# Altium schematic sheet BOOST CNTRL CARD.SchDoc
size A3; SheetNumber: 1; SheetTotal: 2; SPICEModelCacheXBHTOMAF: <root> / <DocumentId>XBHTOMAF</DocumentId> / <CacheFrame Number="0"> / <Model Name="0805_885012207098_100nf" Kind="CKT"> / <Text>******* / .subckt 0805_885012207098_100nF 1 2 / Rser 1 3 0.0175748078756 / Lser 2 4 0.0000000004 / C1 3 4 0.0000001 / Rpar 3 4 5000000000 / .ends 0805_885012207098_100nF</Text> / </Model> / <Model Name="865080753013_47uf" Kind="CKT"> / <Text>******* / .subckt 865080753013_47uF 1 2 / Rser 1 3 0.566 / Lser 2 4 3.250953097E-09 / C1 3 4 0.000047 / Rpar 3 4 2127659.57446809 / .ends 865080753013_47uF</Text> / </Model> / <Model Name="0402_885012205042_470pf" Kind="CKT"> / <Text>******* / .subckt 0402_885012205042_470pF 1 2 / Rser 1 3 0.34662 / Lser 2 4 0.00000000017045 / C1 3 4 0.00000000047 / Rpar 3 4 10000000000 / .ends 0402_885012205042_470pF</Text> / </Model> / <Model Name="0402_885012205085r_100nf" Kind="CKT"> / <Text>******* / .subckt 0402_885012205085R_100nF 1 2 / Rser 1 3 0.035 / Lser 2 4 7.65573672E-10 / C1 3 4 0.0000001 / Rpar 3 4 5000000000 / .ends 0402_885012205085R_100nF</Text> / </Model> / <Model Name="0201_885012204006_1nf" Kind="CKT"> / <Text>******* / .subckt 0201_885012204006_1nF 1 2 / Rser 1 3 0.2367 / Lser 2 4 0.000000000173 / C1 3 4 0.000000001 / Rpar 3 4 10000000000 / .ends 0201_885012204006_1nF</Text> / </Model> / <Model Name="0201_885012204004_10nf" Kind="CKT"> / <Text>******* / .subckt 0201_885012204004_10nF 1 2 / Rser 1 3 0.0709 / Lser 2 4 0.00000000018 / C1 3 4 0.00000001 / Rpar 3 4 10000000000 / .ends 0201_885012204004_10nF</Text> / </Model> / <Model Name="0402_885012005067_1nf" Kind="CKT"> / <Text>******* / .subckt 0402_885012005067_1nF 1 2 / Rser 1 3 0.065 / Lser 2 4 0.000000001 / C1 3 4 0.000000001 / Rpar 3 4 10000000000 / .ends 0402_885012005067_1nF</Text> / </Model> / <Model Name="865230440002_10uf" Kind="CKT"> / <Text>******* / .subckt 865230440002_10uF 1 2 / Rser 1 3 1.95 / Lser 2 4 0.00000000000007 / C1 3 4 0.000022 / Rpar 3 4 8333333.33333333 / .ends 865230440002_10uF</Text> / </Model> / </CacheFrame> / </root>
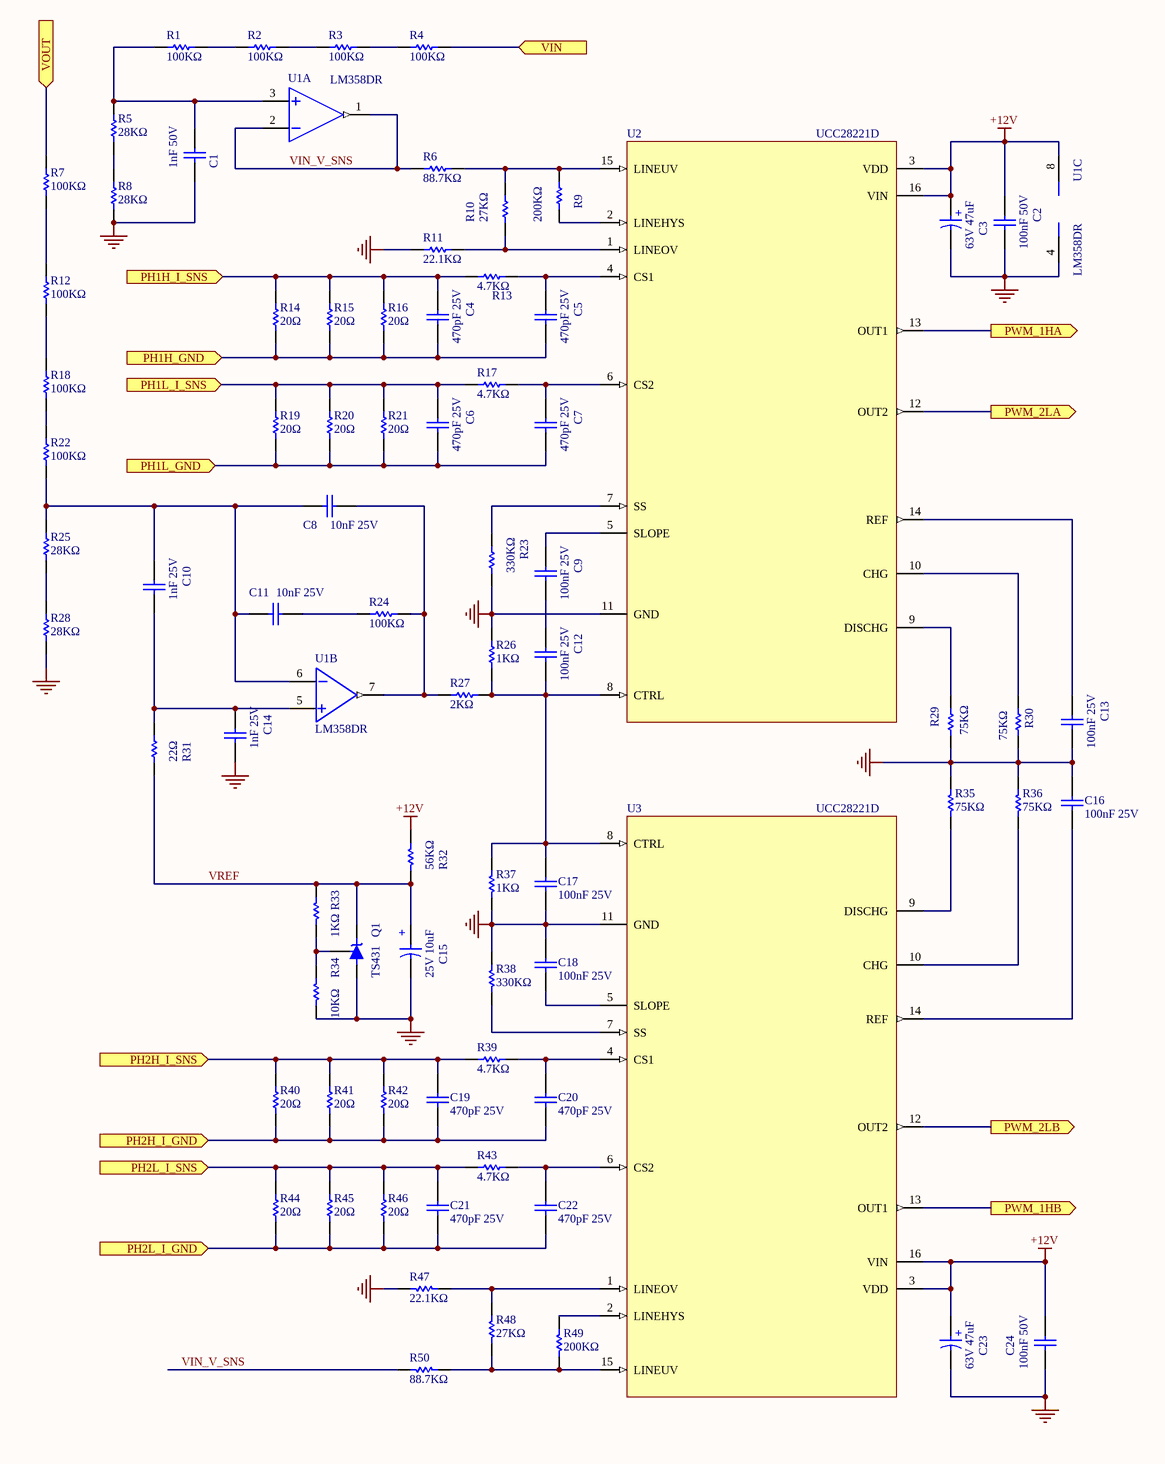
[diagram p0: BOOST CNTRL CARD.SchDoc]

## Parts
C1  1nF 50V  [WCAP-CSGP_0402_L1W0.5H0.5]
C2  100nF 50V  [WCAP-CSGP_0805_L2W1.25H0.8_Reflow]
C3  63V 47uF  [WCAP-ASLI_D8H10.5]
C4  470pF 25V  [WCAP-CSGP_0402_L1W0.5H0.5]
C5  470pF 25V  [WCAP-CSGP_0402_L1W0.5H0.5]
C6  470pF 25V  [WCAP-CSGP_0402_L1W0.5H0.5]
C7  470pF 25V  [WCAP-CSGP_0402_L1W0.5H0.5]
C8  10nF 25V  [WCAP-CSGP_0201_L0.6W0.3H0.3]
C9  100nF 25V  [WCAP-CSGP_0402_L1W0.5H0.5]
C10  1nF 25V  [WCAP-CSGP_0201_L0.6W0.3H0.3]
C11  10nF 25V  [WCAP-CSGP_0201_L0.6W0.3H0.3]
C12  100nF 25V  [WCAP-CSGP_0402_L1W0.5H0.5]
C13  100nF 25V  [WCAP-CSGP_0402_L1W0.5H0.5]
C14  1nF 25V  [WCAP-CSGP_0201_L0.6W0.3H0.3]
C15  25V 10uF  [WCAP-AS5H_D4H5.5]
C16  100nF 25V  [WCAP-CSGP_0402_L1W0.5H0.5]
C17  100nF 25V  [WCAP-CSGP_0402_L1W0.5H0.5]
C18  100nF 25V  [WCAP-CSGP_0402_L1W0.5H0.5]
C19  470pF 25V  [WCAP-CSGP_0402_L1W0.5H0.5]
C20  470pF 25V  [WCAP-CSGP_0402_L1W0.5H0.5]
C21  470pF 25V  [WCAP-CSGP_0402_L1W0.5H0.5]
C22  470pF 25V  [WCAP-CSGP_0402_L1W0.5H0.5]
C23  63V 47uF  [WCAP-ASLI_D8H10.5]
C24  100nF 50V  [WCAP-CSGP_0805_L2W1.25H0.8_Reflow]
Q1  TS431  [TO-92]
R1  100KΩ  [WRIS-RSKS_0402]
R2  100KΩ  [WRIS-RSKS_0402]
R3  100KΩ  [WRIS-RSKS_0402]
R4  100KΩ  [WRIS-RSKS_0402]
R5  28KΩ  [WRIS-RSKS_0402]
R6  88.7KΩ  [WRIS-RSKS_0402]
R7  100KΩ  [WRIS-RSKS_0402]
R8  28KΩ  [WRIS-RSKS_0402]
R9  200KΩ  [WRIS-RSKS_0402]
R10  27KΩ  [WRIS-RSKS_0402]
R11  22.1KΩ  [WRIS-RSKS_0402]
R12  100KΩ  [WRIS-RSKS_0402]
R13  4.7KΩ  [WRIS-RSKS_0402]
R14  20Ω  [WRIS-RSKS_0402]
R15  20Ω  [WRIS-RSKS_0402]
R16  20Ω  [WRIS-RSKS_0402]
R17  4.7KΩ  [WRIS-RSKS_0402]
R18  100KΩ  [WRIS-RSKS_0402]
R19  20Ω  [WRIS-RSKS_0402]
R20  20Ω  [WRIS-RSKS_0402]
R21  20Ω  [WRIS-RSKS_0402]
R22  100KΩ  [WRIS-RSKS_0402]
R23  330KΩ  [WRIS-RSKS_0402]
R24  100KΩ  [WRIS-RSKS_0402]
R25  28KΩ  [WRIS-RSKS_0402]
R26  1KΩ  [WRIS-RSKS_0402]
R27  2KΩ  [WRIS-RSKS_0402]
R28  28KΩ  [WRIS-RSKS_0402]
R29  75KΩ  [WRIS-RSKS_0603_Reflow]
R30  75KΩ  [WRIS-RSKS_0603_Reflow]
R31  22Ω  [WRIS-RSKS_0402]
R32  56KΩ  [WRIS-RSKS_0402]
R33  1KΩ  [WRIS-RSKS_0402]
R34  10KΩ  [WRIS-RSKS_0402]
R35  75KΩ  [WRIS-RSKS_0603_Reflow]
R36  75KΩ  [WRIS-RSKS_0603_Reflow]
R37  1KΩ  [WRIS-RSKS_0402]
R38  330KΩ  [WRIS-RSKS_0402]
R39  4.7KΩ  [WRIS-RSKS_0402]
R40  20Ω  [WRIS-RSKS_0402]
R41  20Ω  [WRIS-RSKS_0402]
R42  20Ω  [WRIS-RSKS_0402]
R43  4.7KΩ  [WRIS-RSKS_0402]
R44  20Ω  [WRIS-RSKS_0402]
R45  20Ω  [WRIS-RSKS_0402]
R46  20Ω  [WRIS-RSKS_0402]
R47  22.1KΩ  [WRIS-RSKS_0402]
R48  27KΩ  [WRIS-RSKS_0402]
R49  200KΩ  [WRIS-RSKS_0402]
R50  88.7KΩ  [WRIS-RSKS_0402]
U1  LM358DR  [SOIC-08-IPC_A]  (parts A,B,C of 3)
U2  UCC28221D  [D0016A_N]
U3  UCC28221D  [D0016A_N]

## Ports
PH1H_GND (in), PH1H_I_SNS (in), PH1L_GND (in), PH1L_I_SNS (in), PH2H_I_GND (in), PH2H_I_SNS (in), PH2L_I_GND (in), PH2L_I_SNS (in), PWM_1HA (out), PWM_1HB (out), PWM_2LA (out), PWM_2LB (out), VIN (in), VOUT (in)

## Nets
+12V: C2.2 C3.1(P) C23.1(P) C24.2 R32.2 U1.8(V+) U2.3(VDD) U2.16(VIN) U3.3(VDD) U3.16(VIN)
GND: C1.1 C2.1 C3.2(N) C13.1 C14.1 C15.2(N) C16.1 C17.2 C18.1 C23.2(N) C24.1 Q1.1(A) R8.1 R11.1 R23.1 R26.2 R28.1 R29.1 R30.1 R34.1 R35.1 R36.1 R37.2 R38.1 R47.1 U1.4(V-) U2.11(GND) U3.11(GND)
PH1H_GND: C4.1 C5.1 R14.1 R15.1 R16.1 ; port PH1H_GND
PH1H_I_SNS: C4.2 R13.1 R14.2 R15.2 R16.2 ; port PH1H_I_SNS
PH1L_GND: C6.1 C7.1 R19.1 R20.1 R21.1 ; port PH1L_GND
PH1L_I_SNS: C6.2 R17.1 R19.2 R20.2 R21.2 ; port PH1L_I_SNS
PH2H_I_GND: C19.1 C20.1 R40.1 R41.1 R42.1 ; port PH2H_I_GND
PH2H_I_SNS: C19.2 R39.1 R40.2 R41.2 R42.2 ; port PH2H_I_SNS
PH2L_I_GND: C21.1 C22.1 R44.1 R45.1 R46.1 ; port PH2L_I_GND
PH2L_I_SNS: C21.2 R43.1 R44.2 R45.2 R46.2 ; port PH2L_I_SNS
PWM_1HA: U2.13(OUT1) ; port PWM_1HA
PWM_1HB: U3.13(OUT1) ; port PWM_1HB
PWM_2LA: U2.12(OUT2) ; port PWM_2LA
PWM_2LB: U3.12(OUT2) ; port PWM_2LB
VIN: R4.2 ; port VIN
VIN_V_SNS: R6.2 R50.2 U1.1(1OUT) U1.2(IN1-)
VOUT: R7.2 ; port VOUT
VREF: C15.1(P) Q1.1(K) R31.1 R32.1 R33.2
NetC1_2: C1.2 R1.1 R5.2 U1.3(IN1+)
NetC5_2: C5.2 R13.2 U2.4(CS1)
NetC7_2: C7.2 R17.2 U2.6(CS2)
NetC8_1: C8.1 C10.2 C11.1 R22.1 R25.2 U1.6(IN2-)
NetC8_2: C8.2 R24.2 R27.1 U1.7(2OUT)
NetC9_1: C9.1 C12.2
NetC9_2: C9.2 U2.5(SLOPE)
NetC10_1: C10.1 C14.2 R31.2 U1.5(IN2+)
NetC11_2: C11.2 R24.1
NetC12_1: C12.1 C17.1 R26.1 R27.2 R37.1 U2.8(CTRL) U3.8(CTRL)
NetC13_2: C13.2 U2.14(REF)
NetC16_2: C16.2 U3.14(REF)
NetC18_2: C18.2 U3.5(SLOPE)
NetC20_2: C20.2 R39.2 U3.4(CS1)
NetC22_2: C22.2 R43.2 U3.6(CS2)
NetQ1_3: Q1.3(REF) R33.1 R34.2
NetR1_2: R1.2 R2.1
NetR2_2: R2.2 R3.1
NetR3_2: R3.2 R4.1
NetR5_1: R5.1 R8.2
NetR6_1: R6.1 R9.2 R10.2 U2.15(LINEUV)
NetR7_1: R7.1 R12.2
NetR9_1: R9.1 U2.2(LINEHYS)
NetR10_1: R10.1 R11.2 U2.1(LINEOV)
NetR12_1: R12.1 R18.2
NetR18_1: R18.1 R22.2
NetR23_2: R23.2 U2.7(SS)
NetR25_1: R25.1 R28.2
NetR29_2: R29.2 U2.9(DISCHG)
NetR30_2: R30.2 U2.10(CHG)
NetR35_2: R35.2 U3.9(DISCHG)
NetR36_2: R36.2 U3.10(CHG)
NetR38_2: R38.2 U3.7(SS)
NetR47_2: R47.2 R48.1 U3.1(LINEOV)
NetR48_2: R48.2 R49.2 R50.1 U3.15(LINEUV)
NetR49_1: R49.1 U3.2(LINEHYS)

## Notes on the sheet
- (in symbol 865080753013) +
- (in symbol 865230440002) +

## Library data of the parts
C1 = 885012005067: WCAP-CSGP Multilayer Ceramic Chip Capacitor, General Purpose, size 0402, NP0, 1nF, 50VDC; Manufacturer: Wurth Elektronik; Case/Size Code: 0402; Capacitance Tolerance: +/-5%; Insulation Resistance: 10GOhm; Q Factor: 1000; Technical Reference: NP00402102J050DFCT10000; Manufacturer Part Number: 885012005067; Category: Multilayer Ceramic Chip Capacitors; Match Code: WCAP-CSGP; ComponentLink1Description: Website Link; ComponentLink1URL: https://www.we-online.com/redexpert/article/885012005067?ad; ComponentLink2Description: Datasheet Link; ComponentLink2URL: https://www.we-online.com/redexpert/spec/885012005067?ad; Mount: Surface Mount; Operating Temperature Max: 125°C; Operating Temperature Min: -55°C; Packaging: Tape and Reel; Length: 1mm; Width: 0.5mm; Height: 0.5mm; Capacitance: 1nF; Ceramic Type: NP0; Rated Voltage (DC): 50V
C2 C24 = 885012207098: WCAP-CSGP Multilayer Ceramic Chip Capacitor, General Purpose, size 0805, X7R, 100nF, 50VDC; Manufacturer: Wurth Elektronik; Case/Size Code: 0805; Capacitance Tolerance: +/-10%; Dissipation Factor: 2.5%; Insulation Resistance: 5GOhm; Technical Reference: X7R0805104K050DFCT10000; Manufacturer Part Number: 885012207098; Category: Multilayer Ceramic Chip Capacitors; Match Code: WCAP-CSGP; ComponentLink1Description: Website Link; ComponentLink1URL: https://www.we-online.com/redexpert/article/885012207098?ad; ComponentLink2Description: Datasheet Link; ComponentLink2URL: https://www.we-online.com/redexpert/spec/885012207098?ad; Mount: Surface Mount; Operating Temperature Max: 125°C; Operating Temperature Min: -55°C; Packaging: Tape and Reel; Length: 2mm; Width: 1.25mm; Height: 0.8mm; Capacitance: 100nF; Ceramic Type: X7R; Rated Voltage (DC): 50V
C3 C23 = 865080753013: WCAP-ASLI Aluminum Electrolytic Capacitor, V-Chip, D8 x H10.5mm, 47uF, 63V; Manufacturer: Wurth Elektronik; Capacitance Tolerance: +/-20%; Dissipation Factor: 12%; Endurance: 2000h; Leakage Current: 29.61uA; Ripple Current: 119mA; Technical Reference: ASEE105470M063DVCTEB000; Manufacturer Part Number: 865080753013; Category: Aluminum Electrolytic Capacitors; Match Code: WCAP-ASLI; ComponentLink1Description: Website Link; ComponentLink1URL: https://www.we-online.com/redexpert/article/865080753013?ad; ComponentLink2Description: Datasheet Link; ComponentLink2URL: https://www.we-online.com/redexpert/spec/865080753013?ad; Mount: Surface Mount; Operating Temperature Max: 105°C; Operating Temperature Min: -55°C; Packaging: Tape and Reel; Height: 10.5mm; Diameter: 8mm; Capacitance: 47uF; Rated Voltage (DC): 63V
C4-C7 C19-C22 = 885012205042: WCAP-CSGP Multilayer Ceramic Chip Capacitor, General Purpose, size 0402, X7R, 470pF, 25VDC; Manufacturer: Wurth Elektronik; Case/Size Code: 0402; Capacitance Tolerance: +/-10%; Dissipation Factor: 3.5%; Insulation Resistance: 10GOhm; Technical Reference: X7R0402471K025DFCT10000; Manufacturer Part Number: 885012205042; Category: Multilayer Ceramic Chip Capacitors; Match Code: WCAP-CSGP; ComponentLink1Description: Website Link; ComponentLink1URL: https://www.we-online.com/redexpert/article/885012205042?ad; ComponentLink2Description: Datasheet Link; ComponentLink2URL: https://www.we-online.com/redexpert/spec/885012205042?ad; Mount: Surface Mount; Operating Temperature Max: 125°C; Operating Temperature Min: -55°C; Packaging: Tape and Reel; Length: 1mm; Width: 0.5mm; Height: 0.5mm; Capacitance: 470pF; Ceramic Type: X7R; Rated Voltage (DC): 25V
C8 C11 = 885012204004: WCAP-CSGP Multilayer Ceramic Chip Capacitor, General Purpose, size 0201, X7R Class II, 10nF, 25VDC; Manufacturer: Wurth Elektronik; Case/Size Code: 0201; Capacitance Tolerance: +/-10%; Dissipation Factor: 10%; Insulation Resistance: 10GOhm; Technical Reference: X7R0201103K025DFCT10000; Manufacturer Part Number: 885012204004; Category: Multilayer Ceramic Chip Capacitors; Match Code: WCAP-CSGP; ComponentLink1Description: Website Link; ComponentLink1URL: https://www.we-online.com/redexpert/article/885012204004?ad; ComponentLink2Description: Datasheet Link; ComponentLink2URL: https://www.we-online.com/redexpert/spec/885012204004?ad; Mount: Surface Mount; Operating Temperature Max: 125°C; Operating Temperature Min: -55°C; Packaging: Tape and Reel; Length: 0.6mm; Width: 0.3mm; Height: 0.3mm; Capacitance: 10nF; Ceramic Type: X7R Class II; Rated Voltage (DC): 25V
C9 C12 C13 C16-C18 = 885012205085R: WCAP-CSGP Multilayer Ceramic Chip Capacitor, General Purpose, size 0402, X7R, 100nF, 25VDC; Manufacturer: Wurth Elektronik; Case/Size Code: 0402; Capacitance Tolerance: +/-10%; Dissipation Factor: 10%; Insulation Resistance: 5GOhm; Technical Reference: X7R0402104K025DFCT20000; Manufacturer Part Number: 885012205085R; Category: Multilayer Ceramic Chip Capacitors; Match Code: WCAP-CSGP; ComponentLink1Description: Website Link; ComponentLink1URL: https://www.we-online.com/redexpert/article/885012205085R?ad; ComponentLink2Description: Datasheet Link; ComponentLink2URL: https://www.we-online.com/redexpert/spec/885012205085R?ad; Mount: Surface Mount; Operating Temperature Max: 125°C; Operating Temperature Min: -55°C; Packaging: Tape and Reel; Length: 1mm; Width: 0.5mm; Height: 0.5mm; Capacitance: 100nF; Ceramic Type: X7R; Rated Voltage (DC): 25V
C10 C14 = 885012204006: WCAP-CSGP Multilayer Ceramic Chip Capacitor, General Purpose, size 0201, X7R Class II, 1nF, 25VDC; Manufacturer: Wurth Elektronik; Case/Size Code: 0201; Capacitance Tolerance: +/-10%; Dissipation Factor: 3.5%; Insulation Resistance: 10GOhm; Technical Reference: X7R0201102K025DFCT10000; Manufacturer Part Number: 885012204006; Category: Multilayer Ceramic Chip Capacitors; Match Code: WCAP-CSGP; ComponentLink1Description: Website Link; ComponentLink1URL: https://www.we-online.com/redexpert/article/885012204006?ad; ComponentLink2Description: Datasheet Link; ComponentLink2URL: https://www.we-online.com/redexpert/spec/885012204006?ad; Mount: Surface Mount; Operating Temperature Max: 125°C; Operating Temperature Min: -55°C; Packaging: Tape and Reel; Length: 0.6mm; Width: 0.3mm; Height: 0.3mm; Capacitance: 1nF; Ceramic Type: X7R Class II; Rated Voltage (DC): 25V
C15 = 865230440002: WCAP-AS5H Aluminum Electrolytic Capacitor, V-Chip, D4 x H5.5mm, 10µF, 25V; Manufacturer: Wurth Elektronik; Capacitance Tolerance: +/-20%; Dissipation Factor: 16%; Endurance: 5000h; Leakage Current: 3uA; Ripple Current: 23mA; Technical Reference: ASDB055100M025DVCTAE000; Manufacturer Part Number: 865230440002; Category: Aluminum Electrolytic Capacitors; Match Code: WCAP-AS5H; ComponentLink1Description: Website Link; ComponentLink1URL: https://www.we-online.com/redexpert/article/865230440002?ad; ComponentLink2Description: Datasheet Link; ComponentLink2URL: https://www.we-online.com/redexpert/spec/865230440002?ad; Mount: Surface Mount; Operating Temperature Max: 105°C; Operating Temperature Min: -40°C; Packaging: Tape and Reel; Height: 5.5mm; Diameter: 4mm; Capacitance: 10uF; Rated Voltage (DC): 25V
Q1 = TS431IZT: V-Ref Adjustable 1.24V to 6V 30mA 3-Pin TO-92 T/R; Manufacturer: STMicroelectronics; Value: Shunt; Supplier: Digikey; Supplier Part Number: 497-TS431IZTCT-ND; Manufacturer Part Number: TS431IZT; RoHS: Yes; Category: Voltage References; Stock: 2472; Pricing: 1=0.81, 10=0.714, 25=0.6708, 100=0.5476, 250=0.50864, 500=0.43288, 1000=0.34631 (USD); ComponentLink1URL: https://datasheet.ciiva.com/41457/001185892-da-01-en-ic-vref-shunt-prec-ts431izt-to-92-3-stm-41457263.pdf?src-supplier=Conrad; ComponentLink1Description: https://datasheet.ciiva.com/41457/001185892-da-01-en-ic-vref-shunt-prec-ts431izt-to-92-3-stm-41457263.pdf?src-supplier=Conrad; ComponentLink2URL: https://datasheet.ciiva.com/4909/cd00001336-4909386.pdf?src-supplier=Mouser; ComponentLink2Description: https://datasheet.ciiva.com/4909/cd00001336-4909386.pdf?src-supplier=Mouser; ComponentLink3URL: https://datasheet.ciiva.com/2006/cd00001336-2006690.pdf?src-supplier=Digikey; ComponentLink3Description: https://datasheet.ciiva.com/2006/cd00001336-2006690.pdf?src-supplier=Digikey; ComponentLink4URL: https://datasheet.ciiva.com/2006/cd00001336-2006691.pdf?src-supplier=Digikey; ComponentLink4Description: https://datasheet.ciiva.com/2006/cd00001336-2006691.pdf?src-supplier=Digikey
R1-R4 R7 R12 R18 R22 R24 = 560112110019: WRIS-RSKS Thick Film Resistor, size 0402, 100000Ohm, 100mW; Manufacturer: Wurth Elektronik; Limiting Element Voltage: 50V; Case/Size Code: 0402; Resistance Tolerance: +/-1%; Temperature Coefficient of Resistance Min: -100ppm/°C; Temperature Coefficient of Resistance Max: 100ppm/°C; Manufacturer Part Number: 560112110019; Resistance: 100000Ohm; Category: Thick Film Resistors; Match Code: WRIS-RSKS; Rated Power: 100mW; ComponentLink1Description: Website Link; ComponentLink1URL: https://www.we-online.com/redexpert/article/560112110019?ad; ComponentLink2Description: Datasheet Link; ComponentLink2URL: https://www.we-online.com/redexpert/spec/560112110019?ad; Mount: Surface Mount; Operating Temperature Max: 155°C; Operating Temperature Min: -55°C; Packaging: Tape and Reel; Length: 1mm; Width: 0.5mm; Height: 0.35mm
R5 R8 R25 R28 = 560112110228: WRIS-RSKS Thick Film Resistor, size 0402, 28000Ohm, 100mW; Manufacturer: Wurth Elektronik; Limiting Element Voltage: 50V; Case/Size Code: 0402; Resistance Tolerance: +/-1%; Temperature Coefficient of Resistance Min: -100ppm/°C; Temperature Coefficient of Resistance Max: 100ppm/°C; Manufacturer Part Number: 560112110228; Resistance: 28000Ohm; Category: Thick Film Resistors; Match Code: WRIS-RSKS; Rated Power: 100mW; ComponentLink1Description: Website Link; ComponentLink1URL: https://www.we-online.com/redexpert/article/560112110228?ad; ComponentLink2Description: Datasheet Link; ComponentLink2URL: https://www.we-online.com/redexpert/spec/560112110228?ad; Mount: Surface Mount; Operating Temperature Max: 155°C; Operating Temperature Min: -55°C; Packaging: Tape and Reel; Length: 1mm; Width: 0.5mm; Height: 0.35mm
R6 R50 = 560112110139: WRIS-RSKS Thick Film Resistor, size 0402, 88700Ohm, 100mW; Manufacturer: Wurth Elektronik; Limiting Element Voltage: 50V; Case/Size Code: 0402; Resistance Tolerance: +/-1%; Temperature Coefficient of Resistance Min: -100ppm/°C; Temperature Coefficient of Resistance Max: 100ppm/°C; Manufacturer Part Number: 560112110139; Resistance: 88700Ohm; Category: Thick Film Resistors; Match Code: WRIS-RSKS; Rated Power: 100mW; ComponentLink1Description: Website Link; ComponentLink1URL: https://www.we-online.com/redexpert/article/560112110139?ad; ComponentLink2Description: Datasheet Link; ComponentLink2URL: https://www.we-online.com/redexpert/spec/560112110139?ad; Mount: Surface Mount; Operating Temperature Max: 155°C; Operating Temperature Min: -55°C; Packaging: Tape and Reel; Length: 1mm; Width: 0.5mm; Height: 0.35mm
R9 R49 = 560112110041: WRIS-RSKS Thick Film Resistor, size 0402, 200000Ohm, 100mW; Manufacturer: Wurth Elektronik; Limiting Element Voltage: 50V; Case/Size Code: 0402; Resistance Tolerance: +/-1%; Temperature Coefficient of Resistance Min: -100ppm/°C; Temperature Coefficient of Resistance Max: 100ppm/°C; Manufacturer Part Number: 560112110041; Resistance: 200000Ohm; Category: Thick Film Resistors; Match Code: WRIS-RSKS; Rated Power: 100mW; ComponentLink1Description: Website Link; ComponentLink1URL: https://www.we-online.com/redexpert/article/560112110041?ad; ComponentLink2Description: Datasheet Link; ComponentLink2URL: https://www.we-online.com/redexpert/spec/560112110041?ad; Mount: Surface Mount; Operating Temperature Max: 155°C; Operating Temperature Min: -55°C; Packaging: Tape and Reel; Length: 1mm; Width: 0.5mm; Height: 0.35mm
R10 R48 = 560112110026: WRIS-RSKS Thick Film Resistor, size 0402, 27000Ohm, 100mW; Manufacturer: Wurth Elektronik; Limiting Element Voltage: 50V; Case/Size Code: 0402; Resistance Tolerance: +/-1%; Temperature Coefficient of Resistance Min: -100ppm/°C; Temperature Coefficient of Resistance Max: 100ppm/°C; Manufacturer Part Number: 560112110026; Resistance: 27000Ohm; Category: Thick Film Resistors; Match Code: WRIS-RSKS; Rated Power: 100mW; ComponentLink1Description: Website Link; ComponentLink1URL: https://www.we-online.com/redexpert/article/560112110026?ad; ComponentLink2Description: Datasheet Link; ComponentLink2URL: https://www.we-online.com/redexpert/spec/560112110026?ad; Mount: Surface Mount; Operating Temperature Max: 155°C; Operating Temperature Min: -55°C; Packaging: Tape and Reel; Length: 1mm; Width: 0.5mm; Height: 0.35mm
R11 R47 = 560112110099: WRIS-RSKS Thick Film Resistor, size 0402, 22100Ohm, 100mW; Manufacturer: Wurth Elektronik; Limiting Element Voltage: 50V; Case/Size Code: 0402; Resistance Tolerance: +/-1%; Temperature Coefficient of Resistance Min: -100ppm/°C; Temperature Coefficient of Resistance Max: 100ppm/°C; Manufacturer Part Number: 560112110099; Resistance: 22100Ohm; Category: Thick Film Resistors; Match Code: WRIS-RSKS; Rated Power: 100mW; ComponentLink1Description: Website Link; ComponentLink1URL: https://www.we-online.com/redexpert/article/560112110099?ad; ComponentLink2Description: Datasheet Link; ComponentLink2URL: https://www.we-online.com/redexpert/spec/560112110099?ad; Mount: Surface Mount; Operating Temperature Max: 155°C; Operating Temperature Min: -55°C; Packaging: Tape and Reel; Length: 1mm; Width: 0.5mm; Height: 0.35mm
R13 R17 R39 R43 = 560112110018: WRIS-RSKS Thick Film Resistor, size 0402, 4700Ohm, 100mW; Manufacturer: Wurth Elektronik; Limiting Element Voltage: 50V; Case/Size Code: 0402; Resistance Tolerance: +/-5%; Temperature Coefficient of Resistance Min: -100ppm/°C; Temperature Coefficient of Resistance Max: 100ppm/°C; Manufacturer Part Number: 560112110018; Resistance: 4700Ohm; Category: Thick Film Resistors; Match Code: WRIS-RSKS; Rated Power: 100mW; ComponentLink1Description: Website Link; ComponentLink1URL: https://www.we-online.com/redexpert/article/560112110018?ad; ComponentLink2Description: Datasheet Link; ComponentLink2URL: https://www.we-online.com/redexpert/spec/560112110018?ad; Mount: Surface Mount; Operating Temperature Max: 155°C; Operating Temperature Min: -55°C; Packaging: Tape and Reel; Length: 1mm; Width: 0.5mm; Height: 0.35mm
R14-R16 R19-R21 R40-R42 R44-R46 = 560112110083: WRIS-RSKS Thick Film Resistor, size 0402, 20Ohm, 100mW; Manufacturer: Wurth Elektronik; Limiting Element Voltage: 50V; Case/Size Code: 0402; Resistance Tolerance: +/-1%; Temperature Coefficient of Resistance Min: -100ppm/°C; Temperature Coefficient of Resistance Max: 100ppm/°C; Manufacturer Part Number: 560112110083; Resistance: 20Ohm; Category: Thick Film Resistors; Match Code: WRIS-RSKS; Rated Power: 100mW; ComponentLink1Description: Website Link; ComponentLink1URL: https://www.we-online.com/redexpert/article/560112110083?ad; ComponentLink2Description: Datasheet Link; ComponentLink2URL: https://www.we-online.com/redexpert/spec/560112110083?ad; Mount: Surface Mount; Operating Temperature Max: 155°C; Operating Temperature Min: -55°C; Packaging: Tape and Reel; Length: 1mm; Width: 0.5mm; Height: 0.35mm
R23 R38 = 560112110088: WRIS-RSKS Thick Film Resistor, size 0402, 330000Ohm, 100mW; Manufacturer: Wurth Elektronik; Limiting Element Voltage: 50V; Case/Size Code: 0402; Resistance Tolerance: +/-1%; Temperature Coefficient of Resistance Min: -100ppm/°C; Temperature Coefficient of Resistance Max: 100ppm/°C; Manufacturer Part Number: 560112110088; Resistance: 330000Ohm; Category: Thick Film Resistors; Match Code: WRIS-RSKS; Rated Power: 100mW; ComponentLink1Description: Website Link; ComponentLink1URL: https://www.we-online.com/redexpert/article/560112110088?ad; ComponentLink2Description: Datasheet Link; ComponentLink2URL: https://www.we-online.com/redexpert/spec/560112110088?ad; Mount: Surface Mount; Operating Temperature Max: 155°C; Operating Temperature Min: -55°C; Packaging: Tape and Reel; Length: 1mm; Width: 0.5mm; Height: 0.35mm
R26 R33 R37 = 560112110012: WRIS-RSKS Thick Film Resistor, size 0402, 1000Ohm, 100mW; Manufacturer: Wurth Elektronik; Limiting Element Voltage: 50V; Case/Size Code: 0402; Resistance Tolerance: +/-1%; Temperature Coefficient of Resistance Min: -100ppm/°C; Temperature Coefficient of Resistance Max: 100ppm/°C; Manufacturer Part Number: 560112110012; Resistance: 1000Ohm; Category: Thick Film Resistors; Match Code: WRIS-RSKS; Rated Power: 100mW; ComponentLink1Description: Website Link; ComponentLink1URL: https://www.we-online.com/redexpert/article/560112110012?ad; ComponentLink2Description: Datasheet Link; ComponentLink2URL: https://www.we-online.com/redexpert/spec/560112110012?ad; Mount: Surface Mount; Operating Temperature Max: 155°C; Operating Temperature Min: -55°C; Packaging: Tape and Reel; Length: 1mm; Width: 0.5mm; Height: 0.35mm
R27 = 560112110064: WRIS-RSKS Thick Film Resistor, size 0402, 2000Ohm, 100mW; Manufacturer: Wurth Elektronik; Limiting Element Voltage: 50V; Case/Size Code: 0402; Resistance Tolerance: +/-1%; Temperature Coefficient of Resistance Min: -100ppm/°C; Temperature Coefficient of Resistance Max: 100ppm/°C; Manufacturer Part Number: 560112110064; Resistance: 2000Ohm; Category: Thick Film Resistors; Match Code: WRIS-RSKS; Rated Power: 100mW; ComponentLink1Description: Website Link; ComponentLink1URL: https://www.we-online.com/redexpert/article/560112110064?ad; ComponentLink2Description: Datasheet Link; ComponentLink2URL: https://www.we-online.com/redexpert/spec/560112110064?ad; Mount: Surface Mount; Operating Temperature Max: 155°C; Operating Temperature Min: -55°C; Packaging: Tape and Reel; Length: 1mm; Width: 0.5mm; Height: 0.35mm
R29 R30 R35 R36 = 560112116063: WRIS-RSKS Thick Film Resistor, size 0603, 75000Ohm, 100mW; Manufacturer: Wurth Elektronik; Limiting Element Voltage: 75V; Case/Size Code: 0603; Resistance Tolerance: +/-1%; Temperature Coefficient of Resistance Min: -100ppm/°C; Temperature Coefficient of Resistance Max: 100ppm/°C; Manufacturer Part Number: 560112116063; Resistance: 75000Ohm; Category: Thick Film Resistors; Match Code: WRIS-RSKS; Rated Power: 100mW; ComponentLink1Description: Website Link; ComponentLink1URL: https://www.we-online.com/redexpert/article/560112116063?ad; ComponentLink2Description: Datasheet Link; ComponentLink2URL: https://www.we-online.com/redexpert/spec/560112116063?ad; Mount: Surface Mount; Operating Temperature Max: 155°C; Operating Temperature Min: -55°C; Packaging: Tape and Reel; Length: 1.6mm; Width: 0.8mm; Height: 0.45mm
R31 = 560112110046: WRIS-RSKS Thick Film Resistor, size 0402, 22Ohm, 100mW; Manufacturer: Wurth Elektronik; Limiting Element Voltage: 50V; Case/Size Code: 0402; Resistance Tolerance: +/-1%; Temperature Coefficient of Resistance Min: -100ppm/°C; Temperature Coefficient of Resistance Max: 100ppm/°C; Manufacturer Part Number: 560112110046; Resistance: 22Ohm; Category: Thick Film Resistors; Match Code: WRIS-RSKS; Rated Power: 100mW; ComponentLink1Description: Website Link; ComponentLink1URL: https://www.we-online.com/redexpert/article/560112110046?ad; ComponentLink2Description: Datasheet Link; ComponentLink2URL: https://www.we-online.com/redexpert/spec/560112110046?ad; Mount: Surface Mount; Operating Temperature Max: 155°C; Operating Temperature Min: -55°C; Packaging: Tape and Reel; Length: 1mm; Width: 0.5mm; Height: 0.35mm
R32 = 560112110031: WRIS-RSKS Thick Film Resistor, size 0402, 56000Ohm, 100mW; Manufacturer: Wurth Elektronik; Limiting Element Voltage: 50V; Case/Size Code: 0402; Resistance Tolerance: +/-1%; Temperature Coefficient of Resistance Min: -100ppm/°C; Temperature Coefficient of Resistance Max: 100ppm/°C; Manufacturer Part Number: 560112110031; Resistance: 56000Ohm; Category: Thick Film Resistors; Match Code: WRIS-RSKS; Rated Power: 100mW; ComponentLink1Description: Website Link; ComponentLink1URL: https://www.we-online.com/redexpert/article/560112110031?ad; ComponentLink2Description: Datasheet Link; ComponentLink2URL: https://www.we-online.com/redexpert/spec/560112110031?ad; Mount: Surface Mount; Operating Temperature Max: 155°C; Operating Temperature Min: -55°C; Packaging: Tape and Reel; Length: 1mm; Width: 0.5mm; Height: 0.35mm
R34 = 560112110006: WRIS-RSKS Thick Film Resistor, size 0402, 10000Ohm, 100mW; Manufacturer: Wurth Elektronik; Limiting Element Voltage: 50V; Case/Size Code: 0402; Resistance Tolerance: +/-5%; Temperature Coefficient of Resistance Min: -100ppm/°C; Temperature Coefficient of Resistance Max: 100ppm/°C; Manufacturer Part Number: 560112110006; Resistance: 10000Ohm; Category: Thick Film Resistors; Match Code: WRIS-RSKS; Rated Power: 100mW; ComponentLink1Description: Website Link; ComponentLink1URL: https://www.we-online.com/redexpert/article/560112110006?ad; ComponentLink2Description: Datasheet Link; ComponentLink2URL: https://www.we-online.com/redexpert/spec/560112110006?ad; Mount: Surface Mount; Operating Temperature Max: 155°C; Operating Temperature Min: -55°C; Packaging: Tape and Reel; Length: 1mm; Width: 0.5mm; Height: 0.35mm
U1 = LM358 OPAMP: IC OPAMP GP 2 CIRCUIT 8SOIC; Output Current: 30mA; Min Dual Supply Voltage: 1.5V; Input Offset Voltage (Vos): 7mV; Power Supply Rejection Ratio (PSRR): 65dB; Unity Gain Bandwidth Product: 700kHz; Number of Channels: 2; Min Supply Voltage: 3V; Max Dual Supply Voltage: 16V; Dual Supply Voltage: 9V; Max Supply Voltage: 32V; Nominal Supply Current: 1.2mA; Slew Rate: 0.3V/µs; Input Bias Current: 250nA; Voltage Gain: 100dB; Operating Supply Current: 1mA; REACH SVHC: No SVHC; Package Quantity: 2500; Width: 3.91mm; Max Operating Temperature: 70°C; Min Operating Temperature: 0°C; Mount: Surface Mount; Length: 4.9mm; Radiation Hardening: No; Case/Package: SOIC; Lead Free: Lead Free; Number of Elements: 2; Packaging: Tape and Reel; Output Current per Channel: 30mA; Number of Circuits: 2; Bandwidth: 700kHz; Operating Supply Voltage: 16V; Gain Bandwidth Product: 700kHz; Number of Pins: 8; Number of Amplifiers: 2; Height: 1.58mm; Common Mode Rejection Ratio: 65dB; Contact Plating: Gold; Value: OPAMP
U2 U3 = UCC28221D: Interleaved Dual PWM Controller with Programmable Max Duty Cycle with Current Control, 90 % Duty Cycle, -40 to +105 degC, 16-pin SOIC (D), Green (RoHS & no Sb/Br); Manufacturer: Texas Instruments; Topology: Flyback, Forward; Rating: Catalog; UVLO Thresholds On/Off(V): 13.0/8.0; Regulated Outputs(#): 2; Frequency(Max)(kHz): 2000; Duty Cycle(Max)(%): 90; Value: BOOST PWM; Mounting Technology: Surface Mount; ComponentLink1URL: http://www.ti.com/general/docs/lit/getliterature.tsp?genericPartNumber=UCC28221&fileType=pdf; PackageReference: D0016A; PackageDescription: 16-Pin Plastic Small Outline Integrated Circuit, 9.9 x 3.9 mm, Pitch 1.27 mm Pitch; Eco-Plan: Green (RoHS & no Sb/Br); PackageVersion: revM, Jun-2011; Code_JEDEC: MS-012AC; Control Method: Current; PartNumber: UCC28221D; DatasheetVersion: SLUS544E; SubFamily: PWM Controller; ComponentLink1Description: Datasheet